# Altium project opo8001.PrjPCB
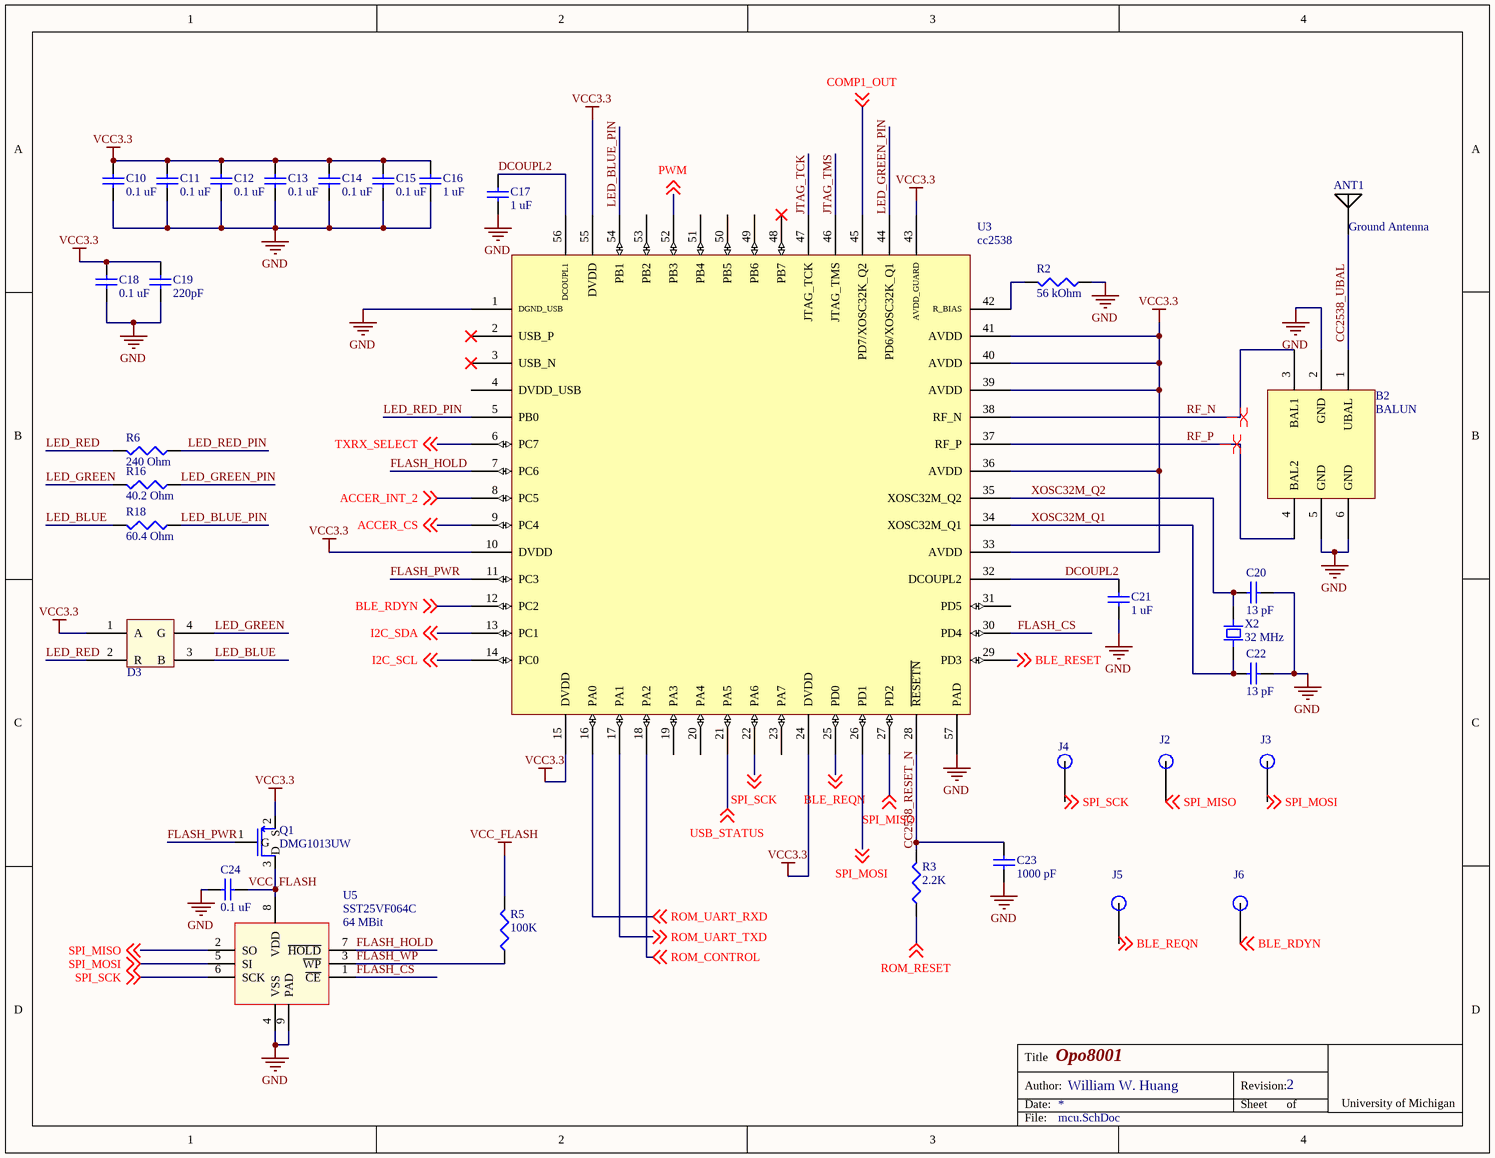
[diagram p0: mcu.SchDoc]
6 sheets, 79 parts. Net scope: global (net labels, ports and power ports of the same name join across sheets).
Board files: opo8001.PcbDoc, opo8001array.PcbDoc
Sheets:
  mcu.SchDoc
  power.SchDoc
  programmer_charger.SchDoc
  bluetooth.SchDoc
  ul_tx_ctrl.SchDoc
  rtc_accel.SchDoc

## Sheet mcu.SchDoc: Opo8001
size Letter; Author: William W. Huang; Organization: Altium Limited; Address1: L3, 12a Rodborough Rd; Address2: Frenchs Forest; Address3: NSW; Address4: Australia 2086; Revision: 2

### Parts
ANT1  Ground Antenna  [SMD Ground Antenna]
B2  BALUN  [2450BM15A0002]
C10  value 0.1 uF  [0402]  (hidden comment: Ceramic capacitor)
C11  value 0.1 uF  [0402]  (hidden comment: Ceramic capacitor)
C12  value 0.1 uF  [0402]  (hidden comment: Ceramic capacitor)
C13  value 0.1 uF  [0402]  (hidden comment: Ceramic capacitor)
C14  value 0.1 uF  [0402]  (hidden comment: Ceramic capacitor)
C15  value 0.1 uF  [0402]  (hidden comment: Ceramic capacitor)
C16  value 1 uF  [0402]  (hidden comment: Ceramic capacitor)
C17  value 1 uF  [0402]  (hidden comment: Ceramic capacitor)
C18  value 0.1 uF  [0402]  (hidden comment: Ceramic capacitor)
C19  value 220pF  [0402]  (hidden comment: 220pF 0402 ceramic cap)
C20  value 13 pF  [0402]  (hidden comment: 13pf 0402 Cap)
C21  value 1 uF  [0402]  (hidden comment: Ceramic capacitor)
C22  value 13 pF  [0402]  (hidden comment: 13pf 0402 Cap)
C23  value 1000 pF  [0402]  (hidden comment: Ceramic capacitor)
C24  value 0.1 uF  [0402]  (hidden comment: Ceramic capacitor)
D3  Tri Color LED  [0404]  (value not drawn)
J2  RCU 0603 SMD Testpoint  [RCU_0603]  (value not drawn)
J3  RCU 0603 SMD Testpoint  [RCU_0603]  (value not drawn)
J4  RCU 0603 SMD Testpoint  [RCU_0603]  (value not drawn)
J5  RCU 0603 SMD Testpoint  [RCU_0603]  (value not drawn)
J6  RCU 0603 SMD Testpoint  [RCU_0603]  (value not drawn)
Q1  DMG1013UW  [SC70-3]
R2  value 56 kOhm  [0402]  (hidden comment: 56k 0402 Res)
R3  value 2.2K  [0402]  (hidden comment: Chip resistor)
R5  value 100K  [0402]  (hidden comment: Chip resistor)
R6  value 240 Ohm  [0402]  (hidden comment: Chip resistor)
R16  value 40.2 Ohm  [0402]  (hidden comment: Chip Resistor)
R18  value 60.4 Ohm  [0402]  (hidden comment: Chip resistor)
U3  cc2538  [QFN50P800X800X100_HS-57N]
U5  SST25VF064C  Capacity: 64 MBit  [WSON]
X2  value 32 MHz  [FA-128]  (hidden comment: 32 MHz Crystal)

### Nets
GND: B2.2(GND) B2.5(GND) B2.6(GND) C10.2 C11.2 C12.2 C13.2 C14.2 C15.2 C16.2 C17.2 C18.2 C19.2 C20.2 C21.2 C22.1 C23.2 C24.1 R2.2 U3.1(DGND_USB) U3.57(PAD) U5.4(VSS) U5.9(PAD)
VCC3.3: C10.1 C11.1 C12.1 C13.1 C14.1 C15.1 C16.1 C18.1 C19.1 D3.1(A) Q1.2(S) U3.10(DVDD) U3.15(DVDD) U3.24(DVDD) U3.33(AVDD) U3.36(AVDD) U3.39(AVDD) U3.40(AVDD) U3.41(AVDD) U3.43(AVDD_GUARD) U3.55(DVDD)
VCC_FLASH: C24.2 Q1.3(D) R5.1 U5.8(VDD)
ACCER_CS: U3.9(PC4) ; off-sheet ACCER_CS
ACCER_INT_2: U3.8(PC5) ; off-sheet ACCER_INT_2
BLE_RDYN: J6.1(J) U3.12(PC2) ; off-sheet BLE_RDYN
BLE_REQN: J5.1(J) U3.25(PD0) ; off-sheet BLE_REQN
BLE_RESET: U3.29(PD3) ; off-sheet BLE_RESET
CC2538_RESET_N: C23.1 R3.1 U3.28(~{RESETN})
CC2538_UBAL: ANT1.1 B2.1(UBAL)
COMP1_OUT: U3.45(PD7/XOSC32K_Q2) ; off-sheet COMP1_OUT
DCOUPL2: C17.1 C21.1 U3.32(DCOUPL2) U3.56(DCOUPL1)
FLASH_CS: U3.30(PD4) U5.1(~{CE})
FLASH_HOLD: U3.7(PC6) U5.7(~{HOLD})
FLASH_PWR: Q1.1(G) U3.11(PC3)
FLASH_WP: R5.2 U5.3(~{WP})
I2C_SCL: U3.14(PC0) ; off-sheet I2C_SCL
I2C_SDA: U3.13(PC1) ; off-sheet I2C_SDA
JTAG_TCK: U3.47(JTAG_TCK)
JTAG_TMS: U3.46(JTAG_TMS)
LED_BLUE: D3.3(B) R18.1
LED_BLUE_PIN: R18.2 U3.54(PB1)
LED_GREEN: D3.4(G) R16.1
LED_GREEN_PIN: R16.2 U3.44(PD6/XOSC32K_Q1)
LED_RED: D3.2(R) R6.1
LED_RED_PIN: R6.2 U3.5(PB0)
PWM: U3.52(PB3) ; off-sheet PWM
RF_N: B2.3(BAL1) U3.38(RF_N)
RF_P: B2.4(BAL2) U3.37(RF_P)
ROM_CONTROL: U3.18(PA2) ; off-sheet ROM_CONTROL
ROM_RESET: R3.2 ; off-sheet ROM_RESET
ROM_UART_RXD: U3.16(PA0) ; off-sheet ROM_UART_RXD
ROM_UART_TXD: U3.17(PA1) ; off-sheet ROM_UART_TXD
SPI_MISO: J2.1(J) U3.27(PD2) U5.2(SO) ; off-sheet SPI_MISO
SPI_MOSI: J3.1(J) U3.26(PD1) U5.5(SI) ; off-sheet SPI_MOSI
SPI_SCK: J4.1(J) U3.22(PA6) U5.6(SCK) ; off-sheet SPI_SCK
TXRX_SELECT: U3.6(PC7) ; off-sheet TXRX_SELECT
USB_STATUS: U3.21(PA5) ; off-sheet USB_STATUS
XOSC32M_Q1: C22.2 U3.34(XOSC32M_Q1) X2.3
XOSC32M_Q2: C20.1 U3.35(XOSC32M_Q2) X2.1
NetR2_1: R2.1 U3.42(R_BIAS)

Not connected (* = marked no-connect by the designer): U3 2(USB_P)* 3(USB_N)* 4(DVDD_USB) 19(PA3) 20(PA4) 23(PA7) 31(PD5) 48(PB7)* 49(PB6) 50(PB5) 51(PB4) 53(PB2)

### Layout directives
differential pair: RF_N, RF_P

### Notes on the sheet
- Title
- Date:
- Author:
- Revision:
- Sheet
- of
- University of Michigan
- File:

### Library data of the parts
ANT1 = Molex Antenna: Molex 2.4 GHz SMD On-Ground Antenna; Supplier 1: Digikey; Supplier Part Number 1: WM4893CT-ND
B2 = cc2538_Balun: Johanson CC253X Balun; Mfr: Johanson Technology; Supplier 1: Digikey; Supplier Part Number 1: 712-1536-1-ND; Mfr Part Number: 2450BM15A0002
C10-C15 C18 C24 = C_0.1u_0402_ceramic: Ceramic capacitor, 0.1u, 0402 package; Manufacture: TDK; voltage rated: 10 V; tolerance: 10%; Supplier 1: Digi-Key; Supplier Part Number 1: 445-1265-1-ND; package: 0402
C16 C17 C21 = C_1u_0402_ceramic: Ceramic capacitor, 1 uF, 0402 package; Manufacture: TDK; voltage rated: 6.3 V; tolerance: 10%; package: 0402; Supplier 1: Digi-Key; Supplier Part Number 1: 445-5000-1-ND
C19 = C_220pf_0402_ceramic: 220pF 5% 50 V C0G NP0 0402 ceramic cap; Mfr: Murata; Mfr Part Number: GRM1555C1H221JA01D; Supplier 1: Digikey; Supplier Part Number 1: 490-1293-1-ND
C20 C22 = C_13p_0402: 13pf, 50V, 2%, c0G, NP0, 0402, ceramic; Mfr: Murata; Mfr Part Number: GRM1555C1H130GA01D; Supplier 1: Digikey; Supplier Part Number 1: 490-8184-1-ND
C23 = C_1000p_0402_ceramic: Ceramic capacitor, 1000 pF, 0402 package; Manufacture: TDK; voltage rated: 50 V; tolerance: 10%; package: 0402; Supplier 1: Digi-Key; Supplier Part Number 1: 445-6846-1-ND
D3 = D_LED_RGB_0404: LED, RGB, 0404; Supplier 1: Digikey; Supplier Part Number 1: SMLP34RGB2W3CT-ND
J2-J6 = Testpoint-0603: 0603 SMD Testpoint; Supplier 1: Digikey; Supplier Part Number 1: A106145CT-ND
Q1 = DMG1013UW: P-CHANNEL ENHANCEMENT MODE MOSFET; Supplier 1: Digi-Key; Supplier Part Number 1: DMG1013UW-7DICT-ND
R2 = R_56K_0402: 56 kOhm, 1%, .0603 W, 0402; Mfr: Rohm; Mfr Part Number: MCR01MRTF5602; Supplier 1: Digikey; Supplier Part Number 1: RHM56.0KCDCT-ND
R3 = R_2.2K_0402: Chip resistor, 2.2K, 0402 package; tolerance: 1%; power: 1/16 W; package: 0402; Supplier 1: Digi-Key; Supplier Part Number 1: 541-2.20KLCT-ND
R5 = R_100K_0402: Chip resistor, 100K, 0402 package; tolerance: 1%; power: 1/16 W; Supplier 1: Digi-Key; Supplier Part Number 1: 541-100KLCT-ND; package: 0402
R6 = R_240_0402: 240 Ohm, 1%, .05W, 0402 Chip Resistor; Supplier 1: Digikey; Supplier Part Number 1: 1276-3965-1-ND
R16 = R_40.2_0402: 40.2 Ohm 0402 1% Chip Resistor; Supplier 1: Digikey; Supplier Part Number 1: RMCF0402FT40R2CT-ND
R18 = R_60.4_0402: 60.4 Ohm, .05W, 1% 0402 Chip Resistor; Supplier 1: DIgikey; Supplier Part Number 1: P60.4LCT-ND
U3 = cc2538: cc2538 MCU/802.15.4 radio; Supplier 1: Digikey; Supplier Part Number 1: 296-35797-1-ND
U5 = SST25VF064C: 64 Mbit SPI Serial Dual I/O Flash; Supplier 1: Digi-Key; Supplier Part Number 1: SST25VF064C-80-4I-Q2AE-CT-ND
X2 = X_32M_FA-128: 32MHz, 10ppm, 10pF, 60 Ohm; Mfr: Epson; Mfr Part Number: FA-128 32.0000MF20X-K3; Supplier 1: Digikey; Supplier Part Number 1: SER3800CT-ND

## Sheet power.SchDoc: Opo001
size Letter; Author: William W. Huang; Organization: Altium Limited; Address1: L3, 12a Rodborough Rd; Address2: Frenchs Forest; Address3: NSW; Address4: Australia 2086; Revision: 2
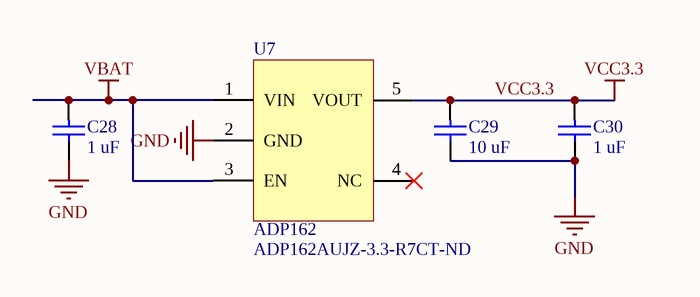
[diagram p1: power.SchDoc]

### Parts
C28  value 1 uF  [0402]  (hidden comment: Ceramic capacitor)
C29  value 10 uF  [0603]  (hidden comment: Ceramic capacitor)
C30  value 1 uF  [0402]  (hidden comment: Ceramic capacitor)
U7  ADP162  Supplier Part Number 1: ADP162AUJZ-3.3-R7CT-ND  [TSOT23-5]

### Nets
GND: C28.2 C29.2 C30.2 U7.2(GND)
VBAT: C28.1 U7.1(VIN) U7.3(EN)
VCC3.3: C29.1 C30.1 U7.5(VOUT)

Not connected (* = marked no-connect by the designer): U7 4(NC)*

### Notes on the sheet
- Title
- Date:
- Author:
- Revision:
- Sheet
- of
- University of Michigan
- File:

### Library data of the parts
C28 C30 = C_1u_0402_ceramic: as C16 on sheet mcu; package: 0402; Supplier 1: Digi-Key; Supplier Part Number 1: 445-5000-1-ND
C29 = C_10u_0603_ceramic: Ceramic capacitor, 10 uF, 0603 package; Manufacture: TDK; voltage rated: 6.3V; tolerance: 20%; package: 0603; Supplier 1: Digi-Key; Supplier Part Number 1: 445-4112-1-ND
U7 = ADP162: Ultralow Quiescent Current,  150 mA, CMOS Linear Regulators; Supplier 1: Digi-Key

## Sheet programmer_charger.SchDoc: Opo8001
size Letter; Author: William W. Huang; Organization: Altium Limited; Address1: L3, 12a Rodborough Rd; Address2: Frenchs Forest; Address3: NSW; Address4: Australia 2086; Revision: 2
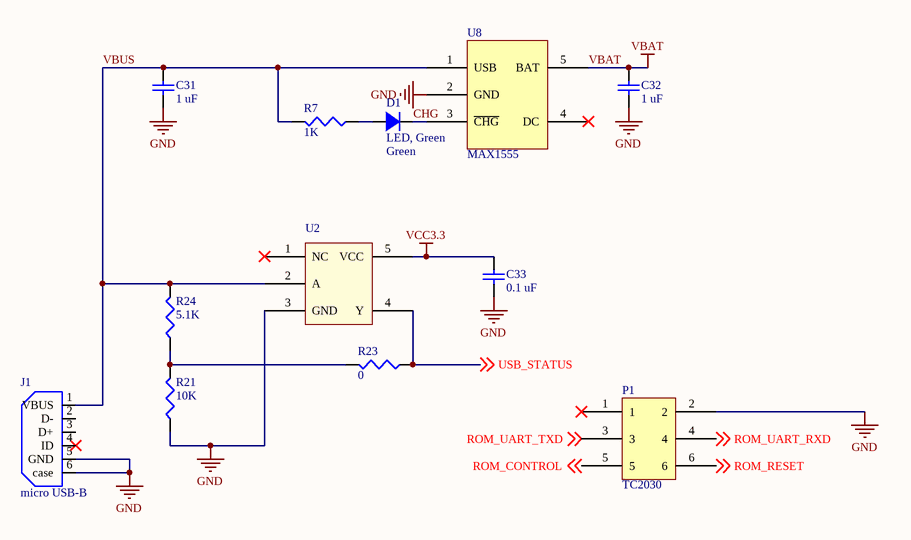
[diagram p2: programmer_charger.SchDoc]

### Parts
C31  value 1 uF  [0402]  (hidden comment: Ceramic capacitor)
C32  value 1 uF  [0402]  (hidden comment: Ceramic capacitor)
C33  value 0.1 uF  [0402]  (hidden comment: Ceramic capacitor)
D1  LED, Green  Color: Green  [0402 - DIODE]
J1  micro USB-B  [Micro USB-B]
P1  TC2030  [TC2030-IDC-NLFP]
R7  value 1K  [0402]  (hidden comment: Chip resistor)
R21  value 10K  [0402]  (hidden comment: Chip resistor)
R23  value 0  [0402]  (hidden comment: Chip resistor)
R24  value 5.1K  [0402]  (hidden comment: Chip resistor)
U2  74LVC1G34GW  [SC-70-5 (DCK)]  (value not drawn)
U8  MAX1555  [SOT23-5]

### Nets
GND: C31.2 C32.2 C33.2 J1.5(GND) J1.6(case) P1.2 R21.2 U2.3(GND) U8.2(GND)
VBAT: C32.1 U8.5(BAT)
VCC3.3: C33.1 U2.5(VCC)
CHG: D1.2 U8.3(~{CHG})
ROM_CONTROL: P1.5 ; off-sheet ROM_CONTROL
ROM_RESET: P1.6 ; off-sheet ROM_RESET
ROM_UART_RXD: P1.4 ; off-sheet ROM_UART_RXD
ROM_UART_TXD: P1.3 ; off-sheet ROM_UART_TXD
USB_STATUS: R23.2 U2.4(Y) ; off-sheet USB_STATUS
VBUS: C31.1 J1.1(VBUS) R7.1 R24.1 U2.2(A) U8.1(USB)
NetD1_1: D1.1 R7.2
NetR21_1: R21.1 R23.1 R24.2

Not connected (* = marked no-connect by the designer): J1 2(D-) 3(D+) 4(ID)*; P1 1*; U2 1(NC)*; U8 4(DC)*

### Notes on the sheet
- Title
- Date:
- Author:
- Revision:
- Sheet
- of
- University of Michigan
- File:

### Library data of the parts
C31 C32 = C_1u_0402_ceramic: as C16 on sheet mcu; package: 0402; Supplier 1: Digi-Key; Supplier Part Number 1: 445-5000-1-ND
C33 = C_0.1u_0402_ceramic: as C10 on sheet mcu; Supplier 1: Digi-Key; Supplier Part Number 1: 445-1265-1-ND; package: 0402
D1 = D_LED_GREEN_0402: LED, Green,  0402; package: 0402; Supplier 1: Digi-Key; Supplier Part Number 1: 511-1592-1-ND
J1 = Micro USB: CONN USB MICRO B RECPT SMT R/A; Supplier 1: Digi-Key; Supplier Part Number 1: 609-4616-6-ND
P1 = TC2030: TC2030-MCP-NL
R7 = R_1K_0402: Chip resistor, 1K, 0402 package; tolerance: 1%; power: 1/16 W; Supplier 1: Digi-Key; Supplier Part Number 1: 541-1.00KLCT-ND; package: 0402
R21 = R_10K_0402: Chip resistor, 10K, 0402 package; tolerance: 1%; power: 1/16 W; Supplier 1: Digi-Key; Supplier Part Number 1: 541-10.0KLDKR-ND; package: 0402
R23 = R_0_0402: Chip resistor, 0, 0402 package; package: 0402; Supplier 1: Digi-Key; Supplier Part Number 1: 541-0.0YBCT-ND
R24 = R_5.1K_0402_1: Chip resistor, 5.1K,  0402 package; tolerance: .5%; power: 1/16 W; package: 0402; Supplier 1: Digi-Key; Supplier Part Number 1: RR05P5.1KDCT-ND
U2 = 74LVC1G34GW: Low power single buffer; Supplier 1: DIgikey; Supplier Part Number 1: 568-7766-1-ND
U8 = MAX1555: 3 Dual-Input USB/AC Adapter 1-Cell Li+  Battery Chargers; Supplier 1: Digi-Key; Supplier Part Number 1: MAX1555EZK+TTR-ND

## Sheet bluetooth.SchDoc: Opo8001
size Letter; Author: William W. Huang; Organization: Altium Limited; Address1: L3, 12a Rodborough Rd; Address2: Frenchs Forest; Address3: NSW; Address4: Australia 2086; Revision: 2
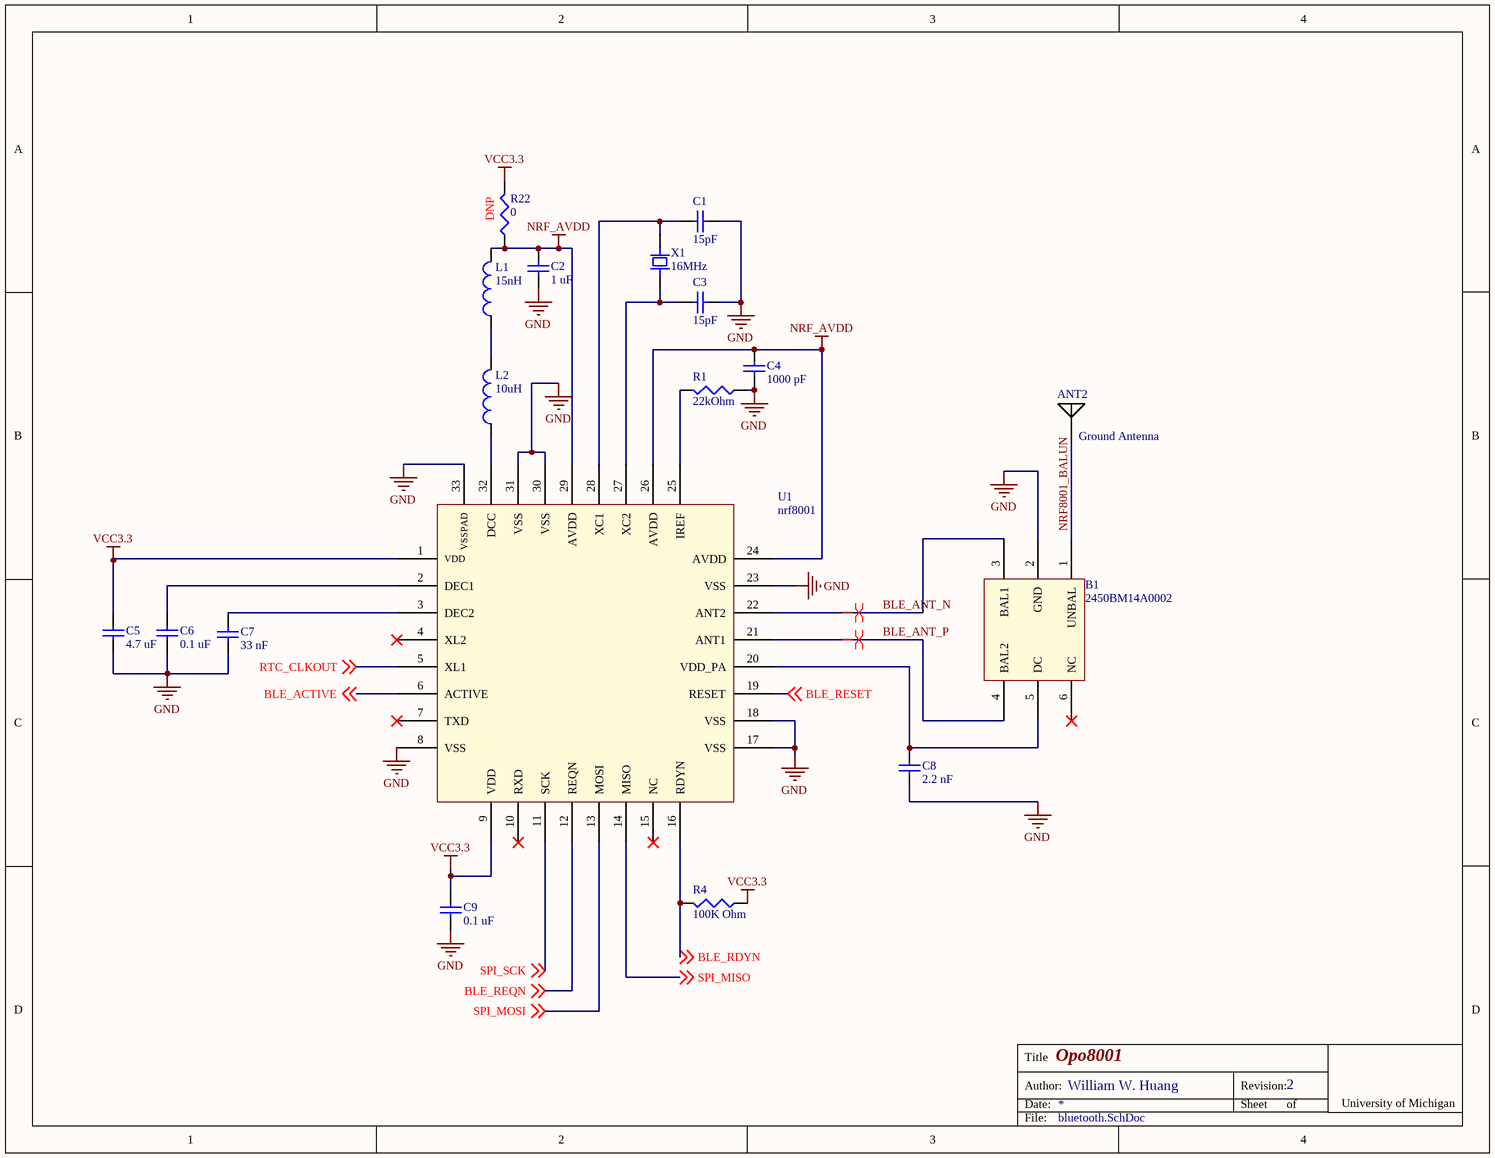
[diagram p3: bluetooth.SchDoc]

### Parts
ANT2  Ground Antenna  [SMD Ground Antenna]
B1  2450BM14A0002  [2450BM14A0002]
C1  value 15pF  [0402]  (hidden comment: 15pF 0402 ceramic cap)
C2  value 1 uF  [0402]  (hidden comment: Ceramic capacitor)
C3  value 15pF  [0402]  (hidden comment: 15pF 0402 ceramic cap)
C4  value 1000 pF  [0402]  (hidden comment: Ceramic capacitor)
C5  value 4.7 uF  [0402]  (hidden comment: 4.7uF)
C6  value 0.1 uF  [0402]  (hidden comment: Ceramic capacitor)
C7  value 33 nF  [0402]  (hidden comment: 33 nF Cap)
C8  value 2.2 nF  [0402]  (hidden comment: 2.2nF Cap)
C9  value 0.1 uF  [0402]  (hidden comment: Ceramic capacitor)
L1  value 15nH  [0402]  (hidden comment: 15nH chip inductor)
L2  value 10uH  [0603]  (hidden comment: 10uH chip inductor)
R1  value 22kOhm  [0402]  (hidden comment: 22k 0402 resistor)
R4  value 100K Ohm  [0402]  (hidden comment: Chip resistor)
R22  value 0  [0402]  (hidden comment: Chip resistor)
U1  nrf8001  [QFN50P500X500X90_HS-33N]
X1  value 16MHz  [TSX-3225]  (hidden comment: 16MHz Crystal)

### Nets
GND: B1.2(GND) C1.2 C2.2 C3.1 C4.2 C5.2 C6.2 C7.2 C8.2 C9.2 R1.2 U1.8(VSS) U1.17(VSS) U1.18(VSS) U1.23(VSS) U1.30(VSS) U1.31(VSS) U1.33(VSSPAD) X1.2 X1.4
NRF_AVDD: C2.1 C4.1 L1.1 R22.2 U1.24(AVDD) U1.26(AVDD) U1.29(AVDD)
VCC3.3: C5.1 C9.1 R4.2 R22.1 U1.1(VDD) U1.9(VDD)
BLE_ACTIVE: U1.6(ACTIVE) ; off-sheet BLE_ACTIVE
BLE_ANT_N: B1.3(BAL1) U1.22(ANT2)
BLE_ANT_P: B1.4(BAL2) U1.21(ANT1)
BLE_RDYN: R4.1 U1.16(RDYN) ; off-sheet BLE_RDYN
BLE_REQN: U1.12(REQN) ; off-sheet BLE_REQN
BLE_RESET: U1.19(RESET) ; off-sheet BLE_RESET
NRF8001_BALUN: ANT2.1 B1.1(UNBAL)
RTC_CLKOUT: U1.5(XL1) ; off-sheet RTC_CLKOUT
SPI_MISO: U1.14(MISO) ; off-sheet SPI_MISO
SPI_MOSI: U1.13(MOSI) ; off-sheet SPI_MOSI
SPI_SCK: U1.11(SCK) ; off-sheet SPI_SCK
NetB1_5: B1.5(DC) C8.1 U1.20(VDD_PA)
NetC1_1: C1.1 U1.28(XC1) X1.1
NetC3_2: C3.2 U1.27(XC2) X1.3
NetC6_1: C6.1 U1.2(DEC1)
NetC7_1: C7.1 U1.3(DEC2)
NetL1_2: L1.2 L2.1
NetL2_2: L2.2 U1.32(DCC)
NetR1_1: R1.1 U1.25(IREF)

Not connected (* = marked no-connect by the designer): B1 6(NC)*; U1 4(XL2)* 7(TXD)* 10(RXD)* 15(NC)*

### Layout directives
differential pair: BLE_ANT_N, BLE_ANT_P

### Notes on the sheet
- (near R22) DNP
- Title
- Date:
- Author:
- Revision:
- Sheet
- of
- University of Michigan
- File:

### Library data of the parts
ANT2 = Molex Antenna: Molex 2.4 GHz SMD On-Ground Antenna; Supplier 1: Digikey; Supplier Part Number 1: WM4893CT-ND
B1 = nrf8001_balun: nrf8001 chip balun; Mfr: Johanson; Mfr Part Number: 2450BM14A0002; Supplier 1: Digikey; Supplier Part Number 1: 712-1574-1-ND
C1 C3 = C_15p_0402_ceramic: 15pF, 2%, NP0, 0402; Mfr: Murata; Mfr Part Number: GRM1555C1H150GA01D; Supplier 1: Digikey; Supplier Part Number 1: 490-6201-1-ND
C2 = C_1u_0402_ceramic: as C16 on sheet mcu; package: 0402; Supplier 1: Digi-Key; Supplier Part Number 1: 445-5000-1-ND
C4 = C_1000p_0402_ceramic: as C23 on sheet mcu; package: 0402; Supplier 1: Digi-Key; Supplier Part Number 1: 445-6846-1-ND
C5 = C_4.7u_0402_ceramic: 4.7 uF 10% 0402 6.3V X5R ceramic cap; Manufacturer: TDK; Supplier 1: Digikey; Supplier Part Number 1: 445-5947-1-ND
C6 C9 = C_0.1u_0402_ceramic: as C10 on sheet mcu; Supplier 1: Digi-Key; Supplier Part Number 1: 445-1265-1-ND; package: 0402
C7 = C_0.033uF_0402_ceramic: 33nF 10% 0402 16V X7R ceramic cap; Manufacturer: Samsung; Supplier 1: Digikey; Supplier Part Number 1: 1276-1177-1-ND
C8 = C_2.2n_0402_ceramic: 2.2nF 10% 50V X7R ceramic cap; Manufacturer: TDK; Supplier 1: Digikey; Supplier Part Number 1: 445-1257-1-ND
L1 = L_15nH_0402: 15 nH, 5%, 460mOhm, 2.3Ghz, 0402 chip inductor; Mfr: Taiyo Yuden; Mfr Part Number: HK100515NJ-T; Supplier 1: Digikey; Supplier Part Number 1: 587-1521-1-ND
L2 = L_10u_0603: 10uH, 10%, 32MHz, 468 mOhm, 0603, chip inductor; Mfr: Taiyo Yuden; Mfr Part Number: LBMF1608T100K; Supplier 1: Digikey; Supplier Part Number 1: 587-1714-1-ND
R1 = R_22k_0402: 22k 1% .063W 0402 resistor; Mfr: Samsung; Mfr Part Number: RC1005F223CS; Supplier 1: Digikey; Supplier Part Number 1: 1276-4143-1-ND
R4 = R_100K_0402: as R5 on sheet mcu; Supplier 1: Digi-Key; Supplier Part Number 1: 541-100KLCT-ND; package: 0402
R22 = R_0_0402: Chip resistor, 0, 0402 package; package: 0402; Supplier 1: Digi-Key; Supplier Part Number 1: 541-0.0YBCT-ND
U1 = nrf8001: nrf8001 Bluetooth SPI module; Supplier 1: Digikey; Supplier Part Number 1: 1490-1026-ND
X1 = TSX-3225: 3.2x2.5mm 16MHz SMD crystal; Mfr: Epson; Mfr part Number: TSX-3225 16.0000MF09Z-AC3; Supplier 1: Digikey; Supplier Part Number 1: SER3628CT-ND

## Sheet ul_tx_ctrl.SchDoc: Opo8001
size Letter; Author: William W. Huang; Organization: Altium Limited; Address1: L3, 12a Rodborough Rd; Address2: Frenchs Forest; Address3: NSW; Address4: Australia 2086; Revision: 2
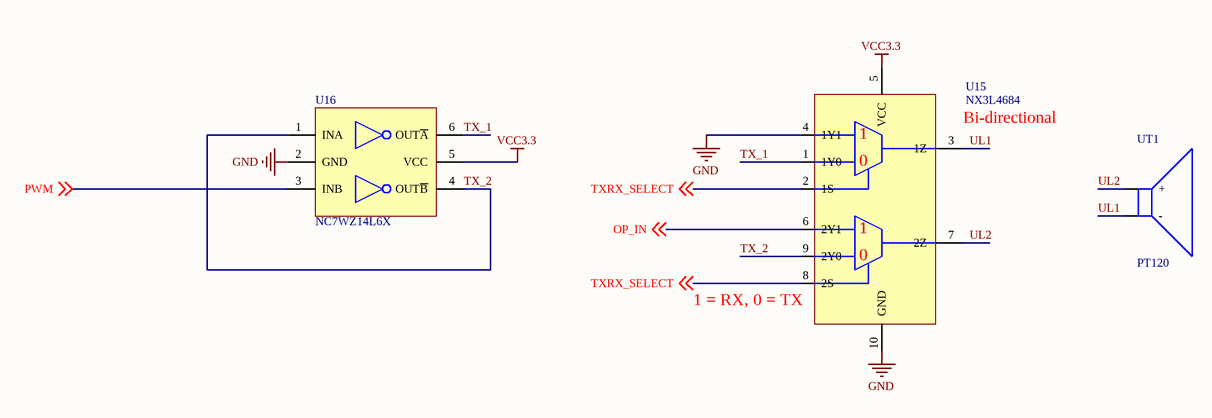
[diagram p4: ul_tx_ctrl.SchDoc]

### Parts
U15  NX3L4684  [QFN50P155X200X13-10N]
U16  NC7WZ14L6X  [NC7WZ14L6X]
UT1  PT120  [PT120]

### Nets
GND: U15.4(1Y1) U15.10(GND) U16.2(GND)
VCC3.3: U15.5(VCC) U16.5(VCC)
OP_IN: U15.6(2Y1) ; off-sheet OP_IN
PWM: U16.3(INB) ; off-sheet PWM
TX_1: U15.1(1Y0) U16.6(OUT~{A})
TX_2: U15.9(2Y0) U16.1(INA) U16.4(OUT~{B})
TXRX_SELECT: U15.2(1S) U15.8(2S) ; off-sheet TXRX_SELECT
UL1: U15.3(1Z) UT1.1(-)
UL2: U15.7(2Z) UT1.2(+)

### Notes on the sheet
- (near U15) Bi-directional
- (near U15) 1 = RX, 0 = TX
- Title
- Date:
- Author:
- Revision:
- Sheet
- of
- University of Michigan
- File:
- (in symbol NX3L4684) 0

### Library data of the parts
U15 = NX3L4684: IC ANALOG SWITCH SPDT 10XQFN; Supplier 1: Digi-Key; Supplier Part Number 1: 568-5564-1-ND
U16 = NC7WZ14L6X: 1 uA supply current, 50 mA output current, Dual inverter; Mfr: Fairchild Semiconductor; Supplier 1: Digikey; Supplier Part Number 1: NC7WZ14L6XFSCT-ND; Mfr Part Number: NC7WZ14L6X
UT1 = PT120: Ultrasonic piezoelectric transceiver, 40 khz,; Supplier 1: Newark; Supplier Part Number 1: 98K9165

## Sheet rtc_accel.SchDoc: Opo8001
size Letter; Author: William W. Huang; Organization: Altium Limited; Address1: L3, 12a Rodborough Rd; Address2: Frenchs Forest; Address3: NSW; Address4: Australia 2086; Revision: 2
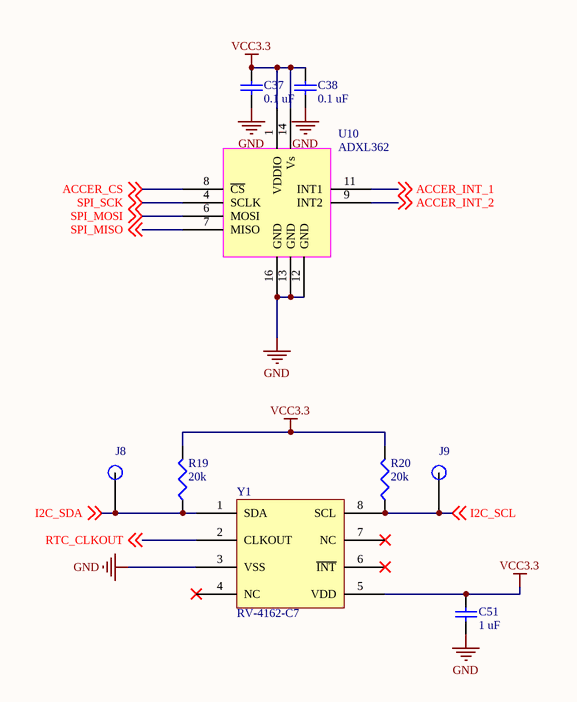
[diagram p5: rtc_accel.SchDoc]

### Parts
C37  value 0.1 uF  [0402]  (hidden comment: Ceramic capacitor)
C38  value 0.1 uF  [0402]  (hidden comment: Ceramic capacitor)
C51  value 1 uF  [0402]  (hidden comment: Ceramic capacitor)
J8  RCU 0603 SMD Testpoint  [RCU_0603]  (value not drawn)
J9  RCU 0603 SMD Testpoint  [RCU_0603]  (value not drawn)
R19  value 20k  [0402]  (hidden comment: 20k Resistor)
R20  value 20k  [0402]  (hidden comment: 20k Resistor)
U10  ADXL362  [LGA_CC-16-4]
Y1  RV-4162-C7  [RV4162]

### Nets
GND: C37.2 C38.2 C51.2 U10.12(GND) U10.13(GND) U10.16(GND) Y1.3(VSS)
VCC3.3: C37.1 C38.1 C51.1 R19.1 R20.1 U10.1(VDDIO) U10.14(Vs) Y1.5(VDD)
ACCER_CS: U10.8(~{CS}) ; off-sheet ACCER_CS
ACCER_INT_1: U10.11(INT1) ; off-sheet ACCER_INT_1
ACCER_INT_2: U10.9(INT2) ; off-sheet ACCER_INT_2
I2C_SCL: J9.1(J) R20.2 Y1.8(SCL) ; off-sheet I2C_SCL
I2C_SDA: J8.1(J) R19.2 Y1.1(SDA) ; off-sheet I2C_SDA
RTC_CLKOUT: Y1.2(CLKOUT) ; off-sheet RTC_CLKOUT
SPI_MISO: U10.7(MISO) ; off-sheet SPI_MISO
SPI_MOSI: U10.6(MOSI) ; off-sheet SPI_MOSI
SPI_SCK: U10.4(SCLK) ; off-sheet SPI_SCK

Not connected (* = marked no-connect by the designer): Y1 4(NC)* 6(~{INT})* 7(NC)*

### Notes on the sheet
- Title
- Date:
- Author:
- Revision:
- Sheet
- of
- University of Michigan
- File:

### Library data of the parts
C37 C38 = C_0.1u_0402_ceramic: as C10 on sheet mcu; Supplier 1: Digi-Key; Supplier Part Number 1: 445-1265-1-ND; package: 0402
C51 = C_1u_0402_ceramic: as C16 on sheet mcu; package: 0402; Supplier 1: Digi-Key; Supplier Part Number 1: 445-5000-1-ND
J8 J9 = Testpoint-0603: 0603 SMD Testpoint; Supplier 1: Digikey; Supplier Part Number 1: A106145CT-ND
R19 R20 = R_20K_0402: 20k ohm, 0402, 1%, .1W; Supplier 1: Digikey; Supplier Part Number 1: RR05P20.0KDCT-ND
U10 = ADXL362: Micropower, 3-Axis, ±2 g/±4 g/±8 g  Digital Output MEMS Accelerometer; Supplier 1: Digi-Key; Supplier Part Number 1: ADXL362BCCZ-RL7CT-ND
Y1 = RV-4162-C7: Real Time Clock Module with I2C Bus; Supplier 1: Newark; Supplier Part Number 1: 09X0517

## Nets that join several sheets
GND: mcu (23 pins), power (C28.2 C29.2 C30.2 U7.2), programmer_charger (9 pins), bluetooth (20 pins), ul_tx_ctrl (U15.4 U15.10 U16.2), rtc_accel (7 pins)
VBAT: power (C28.1 U7.1 U7.3), programmer_charger (C32.1 U8.5)
VCC3.3: mcu (21 pins), power (C29.1 C30.1 U7.5), programmer_charger (C33.1 U2.5), bluetooth (6 pins), ul_tx_ctrl (U15.5 U16.5), rtc_accel (8 pins)
ACCER_CS: mcu (U3.9), rtc_accel (U10.8)
ACCER_INT_2: mcu (U3.8), rtc_accel (U10.9)
BLE_RDYN: mcu (J6.1 U3.12), bluetooth (R4.1 U1.16)
BLE_REQN: mcu (J5.1 U3.25), bluetooth (U1.12)
BLE_RESET: mcu (U3.29), bluetooth (U1.19)
I2C_SCL: mcu (U3.14), rtc_accel (J9.1 R20.2 Y1.8)
I2C_SDA: mcu (U3.13), rtc_accel (J8.1 R19.2 Y1.1)
PWM: mcu (U3.52), ul_tx_ctrl (U16.3)
ROM_CONTROL: mcu (U3.18), programmer_charger (P1.5)
ROM_RESET: mcu (R3.2), programmer_charger (P1.6)
ROM_UART_RXD: mcu (U3.16), programmer_charger (P1.4)
ROM_UART_TXD: mcu (U3.17), programmer_charger (P1.3)
RTC_CLKOUT: bluetooth (U1.5), rtc_accel (Y1.2)
SPI_MISO: mcu (J2.1 U3.27 U5.2), bluetooth (U1.14), rtc_accel (U10.7)
SPI_MOSI: mcu (J3.1 U3.26 U5.5), bluetooth (U1.13), rtc_accel (U10.6)
SPI_SCK: mcu (J4.1 U3.22 U5.6), bluetooth (U1.11), rtc_accel (U10.4)
TXRX_SELECT: mcu (U3.6), ul_tx_ctrl (U15.2 U15.8)
USB_STATUS: mcu (U3.21), programmer_charger (R23.2 U2.4)